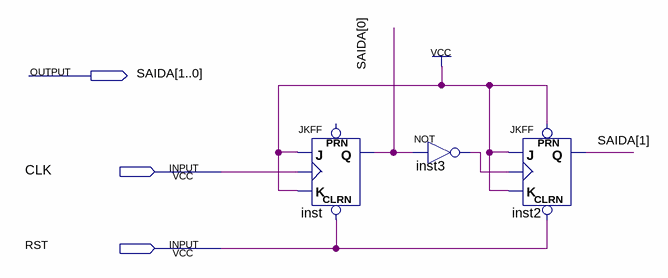
[diagram p0: schematic sheet]
// Quartus schematic CONTADOR_2BITS.bdf as structural Verilog: 3 symbols, 3 pins
module CONTADOR_2BITS (
  input  CLK,
  input  RST,
  output [1:0] SAIDA
);

  wire inst3_out;

  JKFF inst (.CLRN(RST), .K(1'b1), .J(1'b1), .CLK(CLK), .Q(SAIDA[0]));  // open: PRN
  not inst3 (inst3_out, SAIDA[0]);
  JKFF inst2 (.PRN(1'b1), .CLRN(RST), .K(1'b1), .J(1'b1), .CLK(inst3_out), .Q(SAIDA[1]));
endmodule
